# EAGLE design Reflow Control Board (EAGLE 6.5.0)
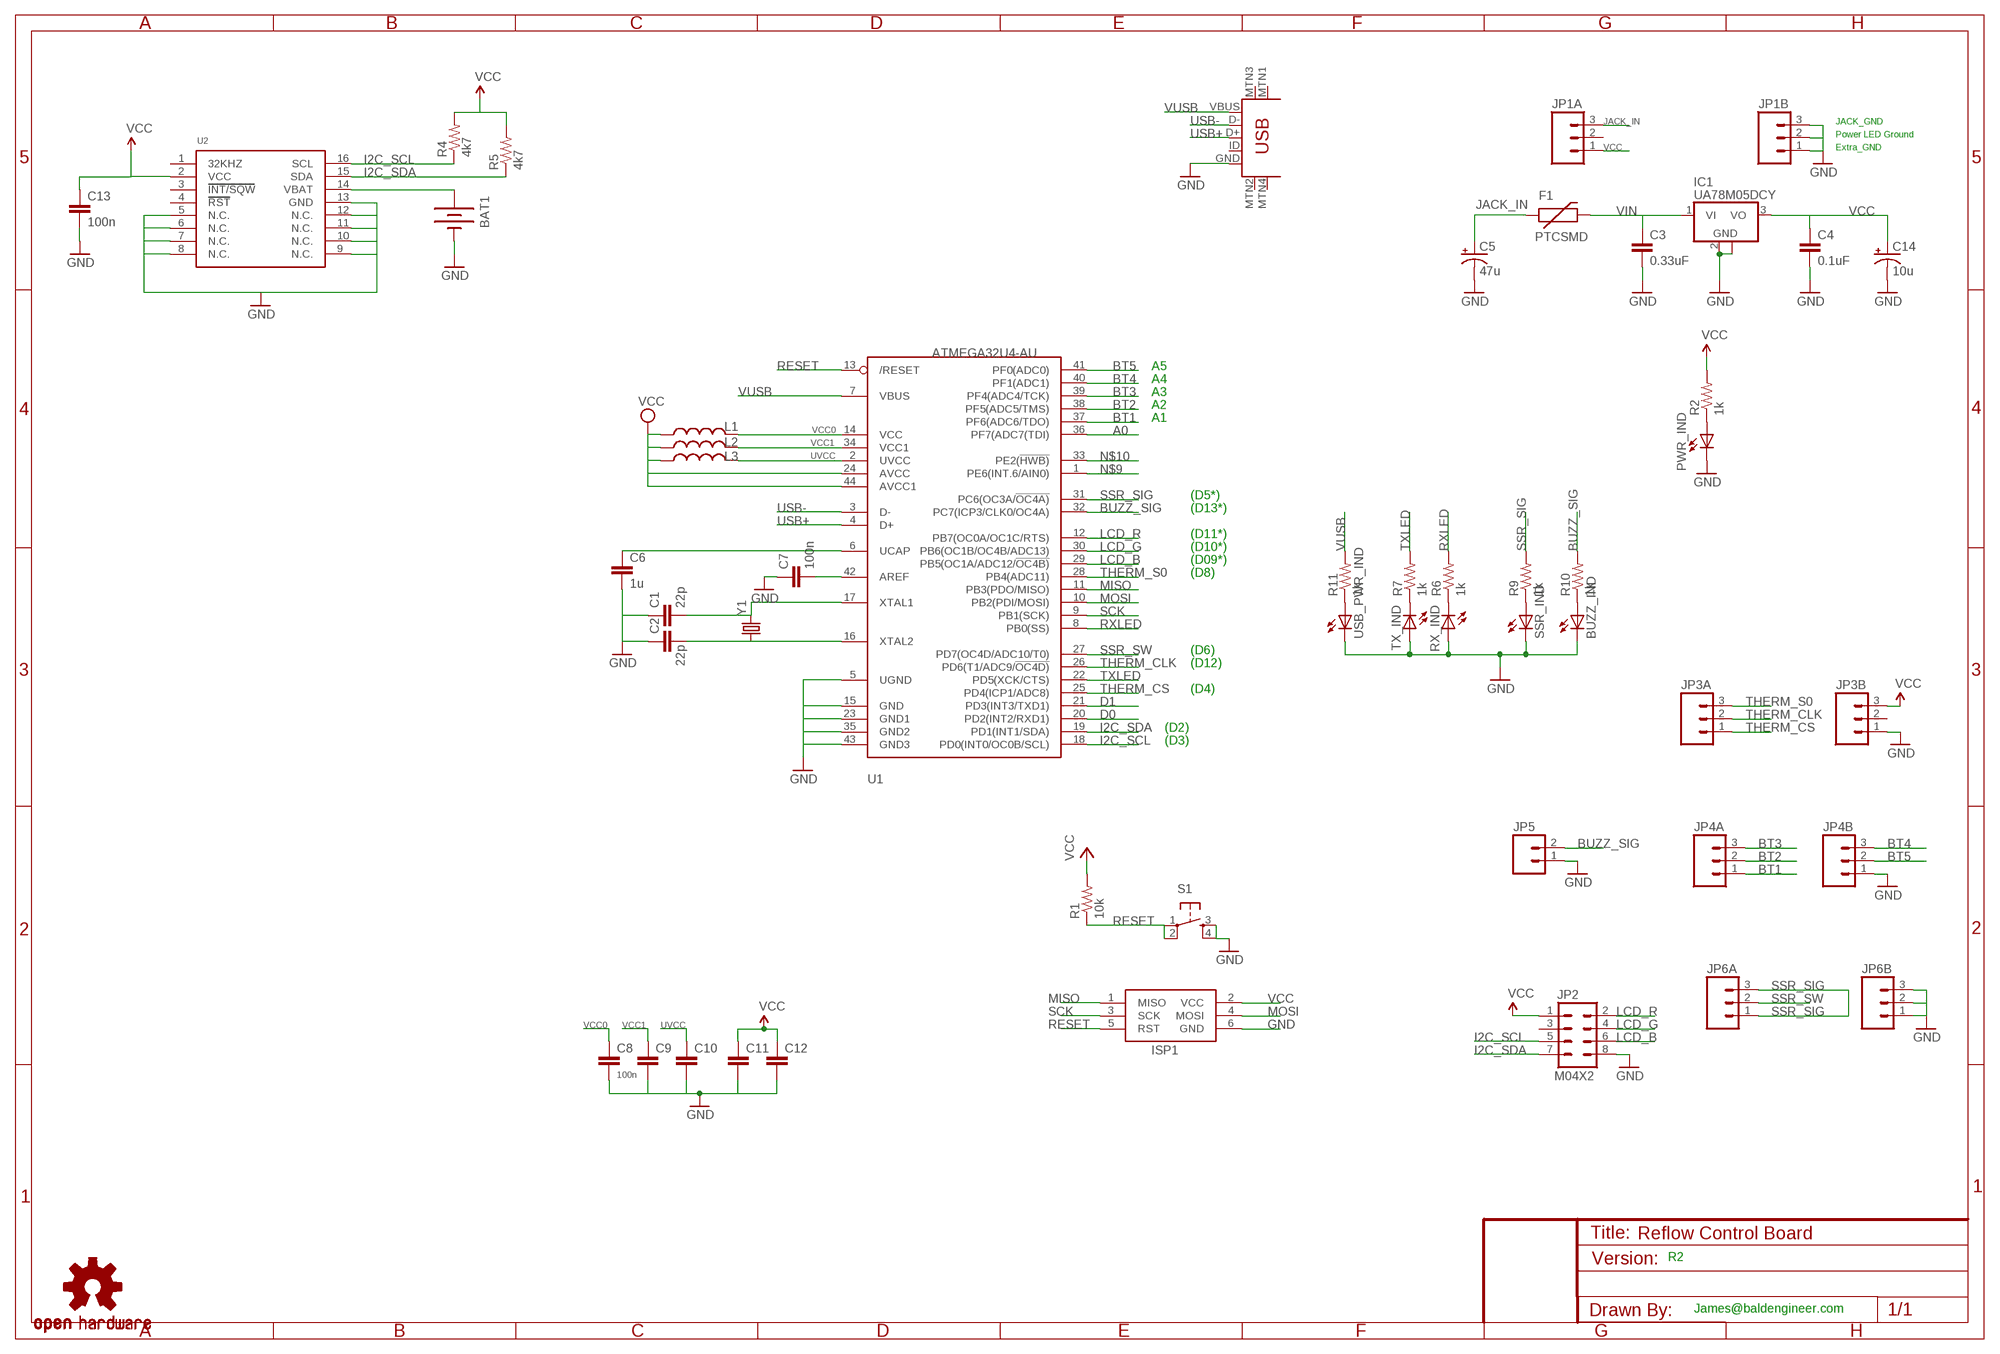
[diagram p0: schematic, sheet 1]

## Parts
BAT1  BATTERY12MM  [BATTCON_12MM]
BUZZ_IND  LED1206  [LED-1206]
C1  22p  CAP1206  [1206]
C2  22p  CAP1206  [1206]
C3  0.33uF  CAP1206  [1206]
C4  0.1uF  CAP1206  [1206]
C5  47u  CPOL-USD/7343-31R  [D/7343-31R]
C6  1u  CAP1206  [1206]
C7  100n  CAP1206  [1206]
C8  100n  CAP1206  [1206]
C9  100n  CAP1206  [1206]
C10  100n  CAP1206  [1206]
C11  100n  CAP1206  [1206]
C12  100n  CAP1206  [1206]
C13  100n  CAP1206  [1206]
C14  10u  CPOL-USD/7343-31R  [D/7343-31R]
F1  PTCSMD  [PTC-1206]
IC1  UA78M05DCY  [SOT223]
ISP1  AVRISP-6  [AVRISP]
JP1A  M03LOCK  [1X03_LOCK]
JP1B  M03LOCK  [1X03_LOCK]
JP2  M04X2  [2X4]
JP3A  M03LOCK  [1X03_LOCK]
JP3B  M03LOCK  [1X03_LOCK]
JP4A  M03LOCK  [1X03_LOCK]
JP4B  M03LOCK  [1X03_LOCK]
JP5  M02LOCK  [1X02_LOCK]
JP6A  M03LOCK  [1X03_LOCK]
JP6B  M03LOCK  [1X03_LOCK]
L1  INDUCTOR0805  [0805]
L2  INDUCTOR0805  [0805]
L3  INDUCTOR0805  [0805]
PWR_IND  LED1206  [LED-1206]
R1  10k  RESISTOR1206  [1206]
R2  1k  RESISTOR1206  [1206]
R4  4k7  RESISTOR1206  [1206]
R5  4k7  RESISTOR1206  [1206]
R6  1k  RESISTOR1206  [1206]
R7  1k  RESISTOR1206  [1206]
R9  1k  RESISTOR1206  [1206]
R10  1k  RESISTOR1206  [1206]
R11  1k  RESISTOR1206  [1206]
RX_IND  LED1206  [LED-1206]
S1  TAC_SWITCHSMD  [TACTILE_SWITCH_SMD]
SSR_IND  LED1206  [LED-1206]
TX_IND  LED1206  [LED-1206]
U1  ATMEGA32U4-AU  [TQFP44]
U2  DS3231  [SO16L]
U$3  USB-MINIB-5PIN  [USB-MINIB]
U$4  OSHW-LOGOS  [OSHW-LOGO-S]
USB_PWR_IND  LED1206  [LED-1206]
Y1  CRYSTALHC49US  [HC49US]

## Nets
A0: U1.36(PF7(ADC7(TDI))
BT1: JP4A.1 U1.37(PF6(ADC6/TDO))
BT2: JP4A.2 U1.38(PF5(ADC5/TMS))
BT3: JP4A.3 U1.39(PF4(ADC4/TCK))
BT4: JP4B.3 U1.40(PF1(ADC1))
BT5: JP4B.2 U1.41(PF0(ADC0))
BUZZ_SIG: JP5.2 R10.2 U1.32(PC7(ICP3/CLK0/OC4A))
D0: U1.20(PD2(INT2/RXD1))
D1: U1.21(PD3(INT3/TXD1))
GND: BAT1.GND(-) BUZZ_IND.C C1.1 C2.1 C3.2 C4.2 C5.- C6.2 C7.1 C8.2 C9.2 C10.2 C11.2 C12.2 C13.2 C14.- IC1.2(GND) IC1.4(GND) ISP1.6(GND) JP1B.1 JP1B.2 JP1B.3 JP2.8 JP3B.1 JP4B.1 JP5.1 JP6B.1 JP6B.2 JP6B.3 PWR_IND.C RX_IND.A S1.3 S1.4 SSR_IND.C TX_IND.A U1.5(UGND) U1.15(GND) U1.23(GND1) U1.35(GND2) U1.43(GND3) U2.5(N.C.) U2.6(N.C.) U2.7(N.C.) U2.8(N.C.) U2.9(N.C.) U2.10(N.C.) U2.11(N.C.) U2.12(N.C.) U2.13(GND) U$3.GND USB_PWR_IND.C
I2C_SCL: JP2.5 R4.1 U1.18(PD0(INT0/OC0B/SCL)) U2.16(SCL)
I2C_SDA: JP2.7 R5.1 U1.19(PD1(INT1/SDA)) U2.15(SDA)
JACK_IN: C5.+ F1.1 JP1A.3
LCD_B: JP2.6 U1.29(PB5(OC1A/ADC12/!OC4B))
LCD_G: JP2.4 U1.30(PB6(OC1B/OC4B/ADC13))
LCD_R: JP2.2 U1.12(PB7(OC0A/OC1C/RTS))
MISO: ISP1.1(MISO) U1.11(PB3(PDO/MISO))
MOSI: ISP1.4(MOSI) U1.10(PB2(PDI/MOSI))
N$1: C1.2 U1.17(XTAL1) Y1.2
N$2: C2.2 U1.16(XTAL2) Y1.1
N$3: R7.1 TX_IND.C
N$4: C6.1 U1.6(UCAP)
N$5: C7.2 U1.42(AREF)
N$6: PWR_IND.A R2.1
N$7: R6.1 RX_IND.C
N$8: R9.1 SSR_IND.A
N$9: U1.1(PE6(INT.6/AIN0))
N$10: U1.33(PE2(!HWB))
N$12: BAT1.PWR@2(+) U2.14(VBAT)
N$14: BUZZ_IND.A R10.1
N$15: R11.1 USB_PWR_IND.A
RESET: ISP1.5(RST) R1.1 S1.1 S1.2 U1.13(/RESET)
RXLED: R6.2 U1.8(PB0(SS))
SCK: ISP1.3(SCK) U1.9(PB1(SCK))
SSR_SIG: JP6A.1 JP6A.3 R9.2 U1.31(PC6(OC3A/!OC4A))
SSR_SW: JP6A.2 U1.27(PD7(OC4D/ADC10/T0))
THERM_CLK: JP3A.2 U1.26(PD6(T1/ADC9/!OC4D))
THERM_CS: JP3A.1 U1.25(PD4(ICP1/ADC8))
THERM_S0: JP3A.3 U1.28(PB4(ADC11))
TXLED: R7.2 U1.22(PD5(XCK/CTS))
USB+: U1.4(D+) U$3.D+
USB-: U1.3(D-) U$3.D-
UVCC: C10.1 L3.2 U1.2(UVCC)
VCC: C4.1 C11.1 C12.1 C13.1 C14.+ IC1.3(VO) ISP1.2(VCC) JP1A.1 JP2.1 JP3B.3 L1.1 L2.1 L3.1 R1.2 R2.2 R4.2 R5.2 U1.24(AVCC) U1.44(AVCC1) U2.2(VCC)
VCC0: C8.1 L1.2 U1.14(VCC)
VCC1: C9.1 L2.2 U1.34(VCC1)
VIN: C3.1 F1.2 IC1.1(VI)
VUSB: R11.2 U1.7(VBUS) U$3.VBUS
Unconnected: JP1A.2 JP2.3 JP3B.2 U2.1(32KHZ) U2.3(INT/SQW) U2.4(RST) U$3.ID U$3.MTN1(MTN2) U$3.MTN2(MTN3) U$3.MTN3(MTN1) U$3.MTN4

## Notes on the sheet
- JACK_GND
- Power LED Ground
- Extra_GND
- A5
- A4
- A3
- A2
- A1
- (D5*)
- (D13*)
- (D11*)
- (D10*)
- (D09*)
- (D8)
- (D6)
- (D12)
- (D4)
- (D2)
- (D3)
- R2
- James@baldengineer.com

## Library data of the parts
BAT1 = Add-Ohms:BATTERY: Battery Holders Various common sizes : AA, AAA, 20mm coin cell and 12mm coin cell.
BUZZ_IND PWR_IND RX_IND SSR_IND TX_IND USB_PWR_IND = Add-Ohms:LED: LEDs Standard schematic elements and footprints for 5mm, 3mm, 1206, and 0603 sized LEDs. 5mm - Spark Fun Electronics SKU : COM-00529 (and others)
C1-C4 C6-C13 = Add-Ohms:CAP: Capacitor Standard 0603 ceramic capacitor, and 0.1" leaded capacitor.
C5 C14 = rcl:CPOL-US: POLARIZED CAPACITOR, American symbol
F1 = SparkFun:PTC: Resettable Fuse PTC Resettable Fuse. Spark Fun Electronics SKU : COM-08357
IC1 = linear:UA78M*: POSITIVE-VOLTAGE REGULATORS Source: http://focus.ti.com/lit/ds/symlink/ua78m33.pdf
ISP1 = adafruit:AVRISP: AVR ISP HEADER Standard 6 pin header for AVR programming
JP1A JP1B JP3A JP3B JP4A JP4B JP6A JP6B = SparkFun:M03: Header 3 Standard 3-pin 0.1" header. Use with straight break away headers (SKU : PRT-00116), right angle break away headers (PRT-00553), swiss pins (PRT-00743), machine pins (PRT-00117), and female headers (PRT-00115). Molex polarized connector foot print use with SKU : PRT-08232 with associated crimp pins and housings.
JP2 = SparkFun:M04X2
JP5 = SparkFun:M02: Header 2 Standard 2-pin 0.1" header. Use with straight break away headers (SKU : PRT-00116), right angle break away headers (PRT-00553), swiss pins (PRT-00743), machine pins (PRT-00117), and female headers (PRT-00115). Molex polarized connector foot print use with SKU : PRT-08233 with associated crimp pins and housings.
L1-L3 = Add-Ohms:INDUCTOR: Inductors Basic Inductor/Choke - 0603 and 1206. Footprints are not proven and vary greatly between part numbers.
R1 R2 R4-R7 R9-R11 = Add-Ohms:RESISTOR: Resistor Basic schematic elements and footprints for 0603, 1206, and PTH resistors.
S1 = Add-Ohms:TAC_SWITCH: Momentary Switch Button commonly used for reset or general input. Spark Fun Electronics SKU : COM-00097
U1 = adafruit:ATMEGA32U4: http://www.ladyada.net/library/eagle
U2 = Add-Ohms:DS3231: The DS3231 is a low-cost, extremely accurate I2C real- time clock (RTC) with an integrated temperature- compensated crystal oscillator (TCXO) and crystal. Link to maxim-ic.com: http://www.maxim-ic.com/datasheet/index.mvp/id/4627 The package style is the SOIC-16. This Part was created by James Lewis (james@cmiyc.com). The SMD/PCB footprint was obtained from the Sparkfun Eagle Library. This part (as an indepedant library) can be downloaded from cmiyc.com: <insert link>. Last Update: May 28, 2012.
U$3 = SparkFun:USB-MINIB: Mini-USB "B" connector with 5th pin broken out. Created new symbol breaking out 5th "ID" pin in mini/micro USB connector spec. See: http://en.wikipedia.org/wiki/Mini_usb#Cables. Uses same footprint as 4-pin symbol. Also added pins to connect to mounting / shield pads if required (probably not generally needed as signals aren't shielded once they leave the connector).
U$4 = Add-Ohms:OSHW-LOGO: Open Source Hardware Logo This logo indicates the piece of hardware it is found on incorporates a OSHW license and/or adheres to the definition of open source hardware found here: http://freedomdefined.org/OSHW
Y1 = SparkFun:CRYSTAL: Crystals Various standard crystals. Proven footprints. Spark Fun Electronics SKU : COM-00534

## Board
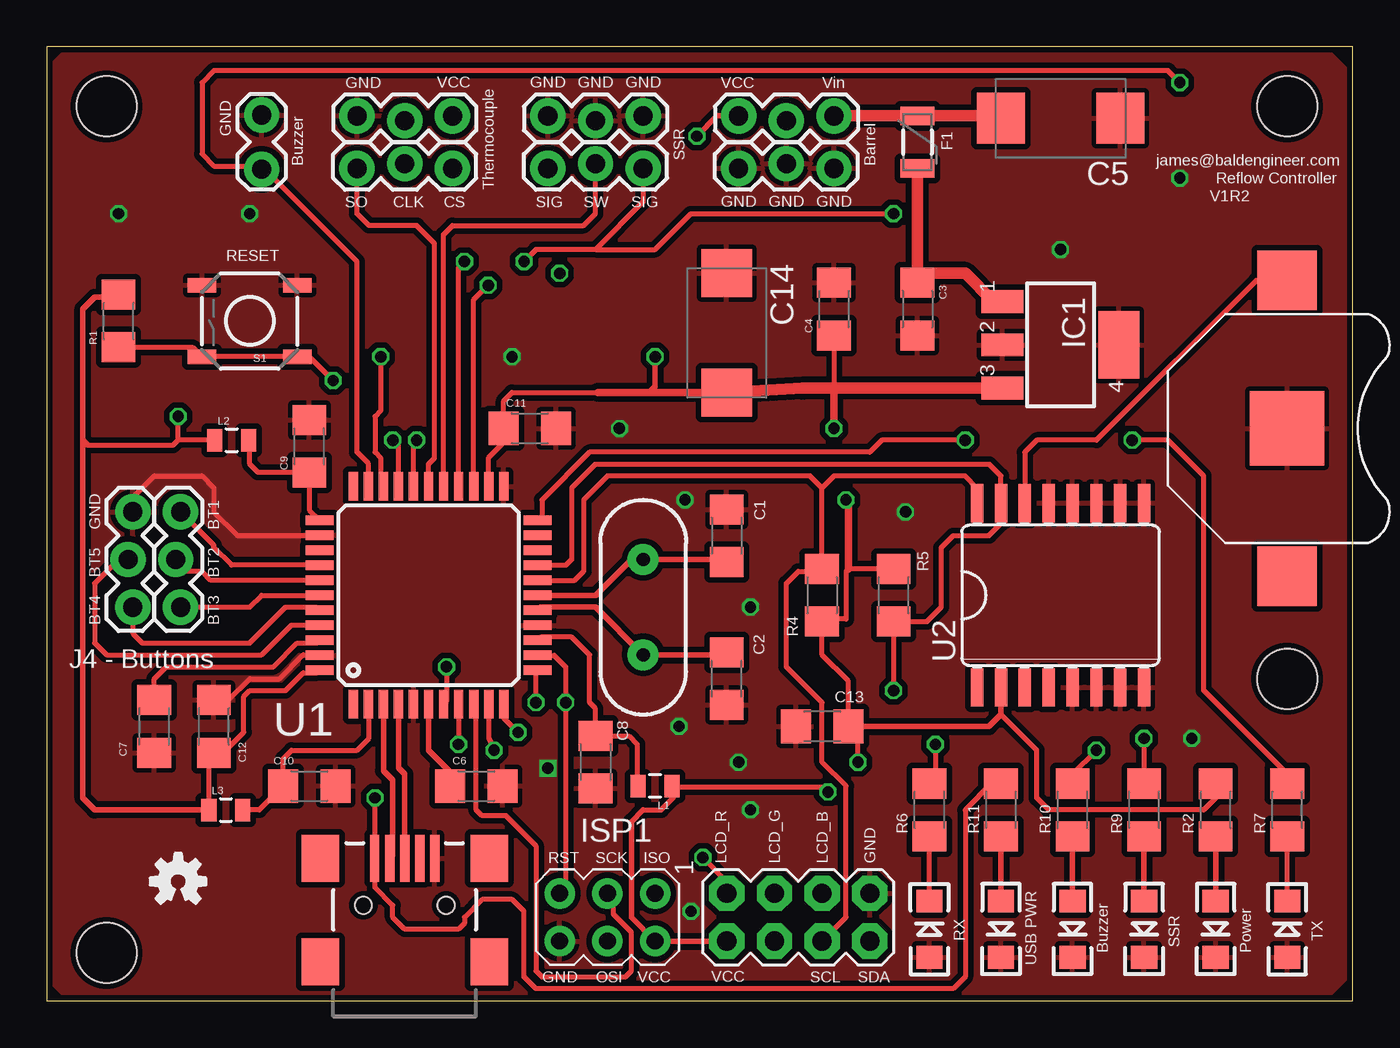
[diagram p1: board, top side]
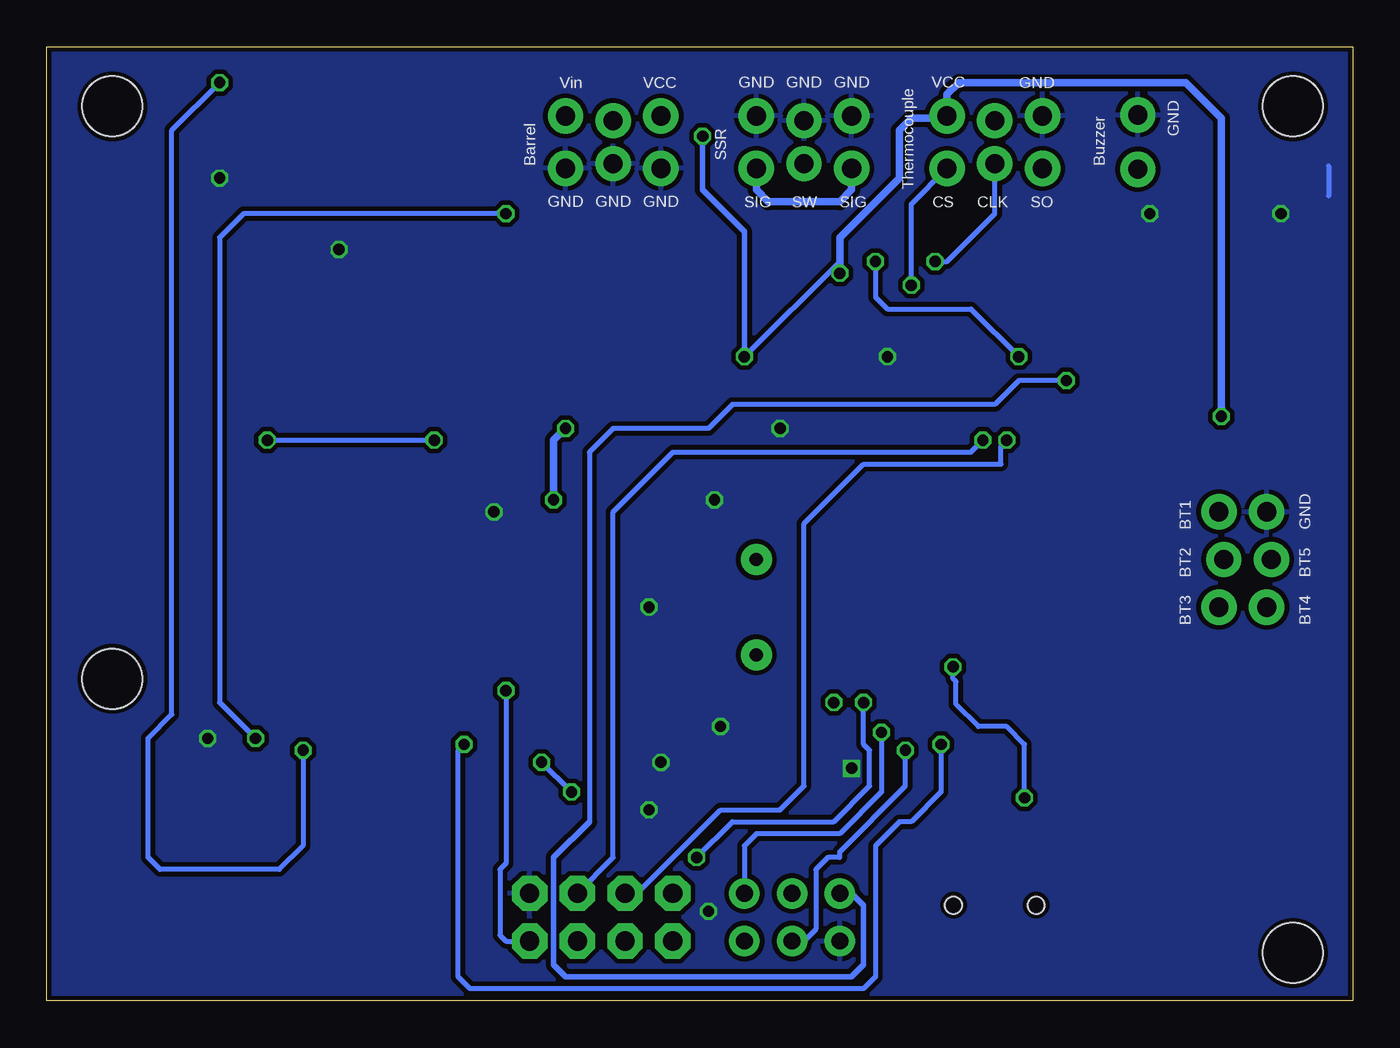
[diagram p2: board, bottom side, seen from below]

Size 69.52 x 50.79 mm. Coordinates in mm from the lower left corner, seen from the top.
Outline: 0,0 69.52,0 69.52,50.79 0,50.79 0,0
Copper layers (1*16): Top 0.035mm / dielectric 1.5mm / Bottom 0.035mm
Design rules "Fusion_eagle_rule_v1.1": minimum track width 6mil, minimum drill 12mil, track to track 6mil, track to pad 6mil, pad to pad 6mil, via to via 6mil, smd to smd 0mil, copper to edge 10mil, drill to drill 10mil, minimum pad ring 10mil, minimum via ring 6mil, stop-mask expansion 2mil, vias tented up to drill 100mil, thermal gap 10mil
Holes 3.2 mm at 3.17,47.62 3.17,2.54 66.04,17.14 66.04,47.62

### Footprints (pad centres in the part's own frame; a part is rotated, then mirrored left to right if it is on the bottom)
BATTCON_12MM = smd 3.962 x 3.962: GND 0,0 | smd 3.175 x 3.175: PWR@1 7.874,0; PWR@2 -7.874,0
LED-1206 = smd 1.2 x 1.4: A -1.5,0; C 1.5,0
1206 = smd 1.6 x 1.8: 1 -1.4,0; 2 1.4,0
D/7343-31R = smd 2.55 x 2.7: + 3.175,0; - -3.175,0
PTC-1206 = smd 1 x 1.8: 1 -1.4,0; 2 1.4,0
SOT223 = smd 1.219 x 2.235: 1 -2.311,-3.099; 2 0,-3.099; 3 2.311,-3.099 | smd 3.6 x 2.2: 4 0,3.099
AVRISP = drill 0.9 pad 1.626: 1 -1.27,2.54; 2 1.27,2.54; 3 -1.27,0; 4 1.27,0; 5 -1.27,-2.54; 6 1.27,-2.54
1X03_LOCK = drill 1.016 pad 1.88: 1 0,0.127; 2 2.54,-0.127; 3 5.08,0.127
2X4 = drill 1.016 pad 1.88 octagon: 1 -3.81,-1.27; 2 -3.81,1.27; 3 -1.27,-1.27; 4 -1.27,1.27; 5 1.27,-1.27; 6 1.27,1.27; 7 3.81,-1.27; 8 3.81,1.27
1X02_LOCK = drill 1.016 pad 1.88: 1 -0.178,0; 2 2.718,0
0805 = smd 0.8 x 1.2: 1 -0.9,0; 2 0.9,0
TACTILE_SWITCH_SMD = smd 1.524 x 0.762: 1 -2.54,1.905; 2 2.54,1.905; 3 -2.54,-1.905; 4 2.54,-1.905
TQFP44 = smd 1.5 x 0.5: 1 -5.8,4; 2 -5.8,3.2; 3 -5.8,2.4; 4 -5.8,1.6; 5 -5.8,0.8; 6 -5.8,0; 7 -5.8,-0.8; 8 -5.8,-1.6; 9 -5.8,-2.4; 10 -5.8,-3.2; 11 -5.8,-4; 23 5.8,-4; 24 5.8,-3.2; 25 5.8,-2.4; 26 5.8,-1.6; 27 5.8,-0.8; 28 5.8,0; 29 5.8,0.8; 30 5.8,1.6; 31 5.8,2.4; 32 5.8,3.2; 33 5.8,4 | smd 0.5 x 1.5: 12 -4,-5.8; 13 -3.2,-5.8; 14 -2.4,-5.8; 15 -1.6,-5.8; 16 -0.8,-5.8; 17 0,-5.8; 18 0.8,-5.8; 19 1.6,-5.8; 20 2.4,-5.8; 21 3.2,-5.8; 22 4,-5.8; 34 4,5.8; 35 3.2,5.8; 36 2.4,5.8; 37 1.6,5.8; 38 0.8,5.8; 39 0,5.8; 40 -0.8,5.8; 41 -1.6,5.8; 42 -2.4,5.8; 43 -3.2,5.8; 44 -4,5.8
SO16L = smd 0.66 x 2.032: 1 -4.445,-4.902; 2 -3.175,-4.902; 3 -1.905,-4.902; 4 -0.635,-4.902; 5 0.635,-4.902; 6 1.905,-4.902; 7 3.175,-4.902; 8 4.445,-4.902; 9 4.445,4.902; 10 3.175,4.902; 11 1.905,4.902; 12 0.635,4.902; 13 -0.635,4.902; 14 -1.905,4.902; 15 -3.175,4.902; 16 -4.445,4.902
USB-MINIB = smd 2.5 x 0.5: D+ 2.5,0; D- 2.5,0.8; GND 2.5,-1.6; ID 2.5,-0.8; VBUS 2.5,1.6 | smd 2.5 x 2: MTN1 -3,4.5; MTN2 2.5,4.5; MTN3 -3,-4.5; MTN4 2.5,-4.5 | hole 0.9: 0,2.2; 0,-2.2
HC49US = drill 0.7 pad 1.651: 1 -2.54,0; 2 2.54,0

### Placement (x,y rotation side)
BAT1  66.04,30.48 270 top
BUZZ_IND  54.61,3.81 270 top
C1  36.2,24.77 270 top
C2  36.2,17.14 90 top
C3  46.35,36.83 270 top
C4  41.91,36.83 90 top
C5  53.98,46.99 180 top
C6  22.86,11.43 0 top
C7  5.71,14.61 90 top
C8  29.21,12.7 270 top
C9  13.97,29.53 90 top
C10  13.97,11.43 0 top
C11  25.72,30.48 0 top
C12  8.89,14.61 90 top
C13  41.27,14.61 180 top
C14  36.2,35.56 270 top
F1  46.35,45.72 270 top
IC1  53.98,34.92 270 top
ISP1  29.84,4.45 270 top
JP1A  36.83,46.99 0 top
JP1B  41.91,44.45 180 top
JP2  40.01,4.45 0 top
JP3A  21.59,44.45 180 top
JP3B  16.51,46.99 0 top
JP4A  6.99,26.04 270 top
JP4B  4.45,26.04 270 top
JP5  11.43,46.99 270 top
JP6A  31.75,44.45 180 top
JP6B  26.67,46.99 0 top
L1  32.38,11.43 180 top
L2  9.84,29.84 0 top
L3  9.53,10.16 0 top
PWR_IND  62.23,3.81 270 top
R1  3.81,36.2 90 top
R2  62.23,10.16 90 top
R4  41.27,21.59 270 top
R5  45.09,21.59 90 top
R6  46.99,10.16 90 top
R7  66.04,10.16 90 top
R9  58.42,10.16 90 top
R10  54.61,10.16 90 top
R11  50.8,10.16 90 top
RX_IND  46.99,3.81 90 top
S1  10.79,36.2 180 top
SSR_IND  58.42,3.81 270 top
TX_IND  66.04,3.81 90 top
U1  20.32,21.59 90 top
U2  53.98,21.59 0 top
U$3  19.05,5.08 90 top
U$4  6.99,6.35 0 top
USB_PWR_IND  50.8,3.81 270 top
Y1  31.75,20.95 90 top

### Tracks (layer width: path | path; a pad name or v marks a point on that pad's centre or on a via)
BT1
  Top 0.254: U1.37 9.83,23.19 8.89,24.13 8.89,24.26 JP4A.1
BT2
  Top 0.254: U1.38 8.72,22.39 8.26,22.86 7.49,22.86 JP4A.2
BT3
  Top 0.254: JP4A.3 10.79,20.95 11.43,21.59 U1.39
BT4
  Top 0.254: JP4B.3 4.57,19.56 5.08,19.05 10.79,19.05 12.7,20.95 14.36,20.95 U1.40
BT5
  Top 0.254: JP4B.2 3.81,23.5 2.54,22.23 2.54,19.05 3.17,18.41 11.43,18.41 13.02,20 14.51,20 U1.41
BUZZ_SIG  (via drill 0.6)
  Top 0.254: U1.32 17.12,28.6 16.51,29.21 16.51,39.37 12.06,43.81 11.89,43.81 JP5.2 11.25,44.45 8.89,44.45 8.26,45.09 8.26,48.9 8.89,49.53 59.69,49.53 v60.33,48.9 | R10.2 54.61,12.06 v55.88,13.34
  Bottom 0.254: v55.88,13.34 55.88,8.26 57.15,6.99 63.5,6.99 64.14,7.62 64.14,13.97 62.87,15.24 62.87,46.35 v60.33,48.9
GND  (via drill 0.6)
  Top 0.254: JP4B.1 4.57,26.8 5.71,27.94 8.26,27.94 8.89,27.3 8.89,26.04 10.16,24.77 14.49,24.77 U1.35 | C12.2 9.65,16 10.79,17.14 12.38,17.14 13.65,18.41 14.49,18.41 U1.43
  Bottom 0.254: 1.27,44.45 1.27,42.86
  other vias: 3.81,41.91 10.79,41.91 60.33,43.81 53.98,40.01 45.72,26.04 60.96,13.97 24.77,34.29 37.47,20.95 33.97,26.67 33.66,14.61 36.83,12.7 30.48,30.48 37.47,10.16 34.29,4.76 26.67,12.38
  pour Bottom (isolate 0.254): 0,50.8 69.22,50.8 69.22,0 0,0
  pour Top (isolate 0.305): 1.27,50.8 67.94,50.8 69.22,49.53 69.22,1.27 67.94,0 1.27,0 0,1.27 0,49.53
I2C_SCL
  Top 0.254: 41.27,27.3 R4.1 41.15,22.86 40.01,22.86 39.37,22.23 39.37,17.78 41.27,15.88 41.27,12.7 42.55,11.43 42.55,4.45 JP2.5 | 41.27,27.3 40.64,27.94 29.84,27.94 28.57,26.67 28.57,22.86 28.11,22.39 U1.18 | U2.16 49.53,27.3 48.9,27.94 41.91,27.94 41.27,27.3
I2C_SDA  (via drill 0.6)
  Top 0.254: U1.19 26.13,23.18 27.62,23.18 27.94,23.5 27.94,27.3 29.21,28.57 50.16,28.57 50.8,27.94 U2.15 50.8,25.4 50.16,24.77 48.26,24.77 47.62,24.13 47.62,20.95 46.86,20.19 R5.1 | R5.1 45.09,20.32 | R5.1 v45.09,16.51
  Bottom 0.254: v45.09,16.51 45.09,7.3 45.4,6.99 45.4,3.49 45.09,3.17 JP2.7
JACK_IN
  Top 0.61: JP1A.3 F1.1 50.67,47.12 C5.+
LCD_B  (via drill 0.6)
  Top 0.254: U1.29 19.52,29.68 v19.68,29.84
  Bottom 0.254: JP2.6 39.37,7.62 39.37,26.04 36.2,29.21 20.32,29.21 v19.68,29.84
LCD_G  (via drill 0.6)
  Top 0.254: U1.30 18.72,29.54 v18.41,29.84
  Bottom 0.254: JP2.4 38.1,5.71 33.66,10.16 30.48,10.16 29.21,11.43 29.21,25.4 26.04,28.57 18.72,28.57 18.72,29.54 v18.41,29.84
LCD_R  (via drill 0.6)
  Top 0.254: JP2.2 36.2,6.35 v34.92,7.62 | v26.04,15.88 26.04,17.5 U1.12
  Bottom 0.254: v34.92,7.62 33.02,9.53 27.62,9.53 25.72,11.43 25.72,13.34 26.04,13.65 v26.04,15.88
MISO  (via drill 0.6)
  Top 0.254: U1.11 24.32,15.05 v25.08,14.29
  Bottom 0.254: v25.08,14.29 25.08,11.11 27.3,8.89 31.75,8.89 32.38,8.26 ISP1.1
MOSI  (via drill 0.6)
  Top 0.254: U1.10 23.52,13.99 v23.81,13.34
  Bottom 0.254: ISP1.4 29.21,3.17 28.57,3.81 28.57,6.99 27.94,7.62 27.3,7.62 27.3,7.94 23.81,11.43 v23.81,13.34
N$1
  Top 0.305: U1.17 29.21,21.59 31.11,23.5 Y1.2 36.06,23.5 C1.2
N$2
  Top 0.305: U1.16 26.29,20.95 29.21,20.95 Y1.1 36.06,18.41 C2.2
N$3
  Top 0.254: TX_IND.C R7.1
N$4
  Top 0.305: C6.1 21.46,12.2 20.32,13.34 U1.6
N$5
  Top 0.254: C7.2 5.71,17.14 6.35,17.78 12.06,17.78 13.34,19.05 14.38,19.05 U1.42
N$6
  Top 0.305: R2.1 PWR_IND.A
N$7
  Top 0.254: RX_IND.C R6.1
N$8
  Top 0.305: R9.1 SSR_IND.A
N$12
  Top 0.254: BAT1.PWR@2 64.39,38.35 55.88,29.84 52.7,29.84 52.07,29.21 U2.14
N$14
  Top 0.305: R10.1 BUZZ_IND.A
N$15
  Top 0.305: R11.1 USB_PWR_IND.A
RESET  (via drill 0.6)
  Top 0.254: U1.13 27.01,18.39 27.62,17.78 v27.62,15.88 27.62,6.03 ISP1.5 | R1.1 7.75,34.8 S1.2 S1.1 13.97,34.29 v15.24,33.02
  Bottom 0.254: v15.24,33.02 17.78,33.02 19.05,31.75 33.02,31.75 34.29,30.48 39.37,30.48 40.64,29.21 40.64,9.53
  Bottom 0.305: 40.64,9.53 42.55,7.62 42.55,1.91 41.91,1.27 26.67,1.27 26.04,1.91 26.04,5.08 26.67,5.71 ISP1.5
RXLED  (via drill 0.6)
  Top 0.254: U1.8 21.92,13.66 v21.91,13.65 | v47.31,13.65 47.31,11.88 R6.2
  Bottom 0.254: v21.91,13.65 21.91,11.11 23.5,9.53 24.13,9.53 25.4,8.26 25.4,1.27 26.04,0.64 46.99,0.64 47.62,1.27 47.62,13.34 v47.31,13.65
SCK
  Top 0.254: U1.9 22.86,15.65 22.86,10.16 23.18,9.84 24.45,9.84 26.04,8.26 26.04,1.59 26.35,1.27 30.8,1.27 31.11,1.59 31.11,3.65 30.16,4.6 30.16,5.4 ISP1.3
SSR_SIG  (via drill 0.6)
  Top 0.254: JP6A.1 31.75,42.55 29.21,40.01 | 29.21,40.01 26.04,40.01 v25.4,39.37 | v17.78,34.29 17.78,31.43 17.46,31.11 17.46,29.21 17.78,28.89 17.78,27.53 U1.31 | 29.21,40.01 32.38,40.01 34.29,41.91 v45.09,41.91 | v58.42,13.97 R9.2
  Bottom 0.254: v25.4,39.37 25.4,37.47 24.77,36.83 20.32,36.83 v17.78,34.29 | v45.09,41.91 59.05,41.91 60.33,40.64 60.33,15.88 v58.42,13.97
  Bottom 0.406: JP6A.3 26.67,43.18 27.3,42.55 31.11,42.55 31.75,43.18 JP6A.1
SSR_SW
  Top 0.254: U1.27 21.12,40.8 21.59,41.27 28.57,41.27 29.21,41.91 JP6A.2
THERM_CLK  (via drill 0.6)
  Top 0.254: U1.26 21.92,39.06 v22.23,39.37
  Bottom 0.254: v22.23,39.37 21.59,39.37 19.05,41.91 JP3A.2
THERM_CS  (via drill 0.6)
  Top 0.254: U1.25 22.72,37.33 v23.5,38.1
  Bottom 0.254: v23.5,38.1 23.5,42.42 JP3A.1
THERM_S0
  Top 0.254: U1.28 20.32,28.57 20.64,28.89 20.64,40.32 19.68,41.27 17.14,41.27 16.51,41.91 JP3A.3
TXLED  (via drill 0.6)
  Top 0.254: R7.2 66.04,12.06 61.59,16.51 61.59,27.94 59.69,29.84 v57.78,29.84 | v48.9,29.84 44.45,29.84 43.81,29.21 28.89,29.21 26.35,26.67 26.35,25.82 U1.22
  Bottom 0.254: v57.78,29.84 v48.9,29.84
USB+
  Top 0.305: U1.4 18.72,12.39 19.05,12.06 U$3.D+
USB-
  Top 0.305: U1.3 17.92,12.24 18.41,11.75 18.41,7.75 U$3.D-
UVCC
  Top 0.254: U1.2 17.14,15.77 17.14,13.97 16.51,13.34 13.02,13.34 12.57,12.89 C10.1 11.3,10.16 L3.2
VCC  (via drill 0.6)
  Top 0.254: C4.1 41.91,32.61 | L3.1 8.62,12.94 C12.1 9.39,13.21 10.48,14.29 10.48,16.19 10.79,16.51 12.7,16.51 13.65,17.46 14.39,17.46 U1.44 | R5.2 42.67,22.99 42.55,22.86 42.55,20.32 41.41,20.32 R4.2 41.27,18.41 42.67,17.02 C13.1 43.18,14.1 v43.18,12.7 | R2.2 62.23,10.79 61.59,10.16 53.34,10.16 52.7,10.79 52.7,13.34 50.8,15.24 | 31.75,10.16 32.7,10.16 33.34,10.79 33.34,11.38 | 33.34,11.38 L1.1 | 33.34,11.38 41.33,11.38 v41.59,11.11 | 2.17,29.58 6.72,29.58 6.99,29.84 | 6.99,29.84 v6.99,31.11 | L2.1 6.99,29.84 | U1.24 23.5,27.41 23.5,28.89 24.32,29.71 C11.1 24.32,31.94 24.77,32.38 29.34,32.38
  Top 0.305: C13.1 50.16,14.61 50.8,15.24 U2.2 | L3.1 2.54,10.16 1.91,10.79 1.91,29.84 | 1.91,29.84 1.91,36.83 2.54,37.47 3.68,37.47 R1.2 | 2.17,29.58 1.91,29.84 | 31.75,10.16 31.11,9.53 31.11,4.45 ISP1.2 JP2.1 | JP1A.1 35.69,47.12 v34.61,46.04 | v32.38,34.29 32.38,32.7 32.07,32.38
  Top 0.406: C14.+ 32.07,32.38 29.34,32.38 | 27.43,38.6 v27.3,38.73 | 42.67,22.99 42.67,26.54 v42.55,26.67 | v41.91,30.48 41.91,32.61
  Top 0.61: IC1.3 41.91,32.61 40.23,32.61 C14.+
  Bottom 0.254: v41.59,11.11 v43.18,12.7 | 27.3,40.64 27.3,39.37 v32.38,34.29
  Bottom 0.305: v34.61,46.04 34.61,43.18 32.38,40.96 v32.38,34.29
  Bottom 0.406: v27.3,38.73 27.3,40.64 24.13,43.81 24.13,46.35 23.5,46.99 21.72,46.99 JP3B.3 | 21.59,46.99 JP3B.3 | JP3B.3 21.59,48.26 20.95,48.9 8.89,48.9 6.99,46.99 v6.99,31.11 | v42.55,26.67 42.55,29.84 v41.91,30.48
VCC0
  Top 0.254: U1.14 26.3,19.37 27.94,19.37 28.89,18.41 28.89,15.88 29.21,15.56 C8.1 30.98,14.1 31.43,13.65 31.43,11.48 L1.2
VCC1
  Top 0.254: U1.34 13.97,26.14 C9.1 11.24,28.13 10.79,28.57 10.79,29.79 L2.2
VIN
  Top 0.406: C3.1 46.35,38.73 46.99,38.73
  Top 0.61: IC1.1 50.39,37.24 48.9,38.73 46.35,38.73 F1.2
VUSB  (via drill 0.6)
  Top 0.254: v17.46,10.79 17.46,7.58 U$3.VBUS 17.46,7.57 17.46,6.03 18.41,5.08 18.41,4.45 19.05,3.81 21.91,3.81 22.23,4.13 22.23,4.45 23.18,5.4 24.77,5.4 25.4,4.76 25.4,1.27 26.04,0.64 48.26,0.64 48.9,1.27 48.9,10.16 50.3,11.56 R11.2 | v21.27,17.78 21.27,15.94 U1.7
  Bottom 0.254: v17.46,10.79 17.46,13.65 18.41,14.61 19.93,14.61 U1.7 21.12,16.99 21.27,17.14 v21.27,17.78

### Text on the board
tNames: GND | VCC | GND | GND | GND | VCC | Vin | GND | SSR | Buzzer | Barrel | james@baldengineer.com | Thermocouple | GND | GND | GND | V1R2 | Reflow Controller | SO | CLK | CS | SIG | SW | SIG | RESET | BT1 | GND | BT2 | BT5 | BT3 | BT4 | J4 - Buttons | RST | SCK | ISO | LCD_R | LCD_G | LCD_B | GND | RX | Buzzer | SSR | Power | TX | VCC | USB PWR | GND | OSI | VCC | SCL | SDA
bNames: GND | VCC | Thermocouple | GND | GND | GND | VCC | Vin | GND | SSR | Buzzer | Barrel | GND | GND | GND | SO | CLK | CS | SIG | SW | SIG | BT1 | GND | BT2 | BT5 | BT3 | BT4